# Altium schematic sheet CONTROL_MCU.SchDoc
size A4; SheetNumber: 4; SheetTotal: 5
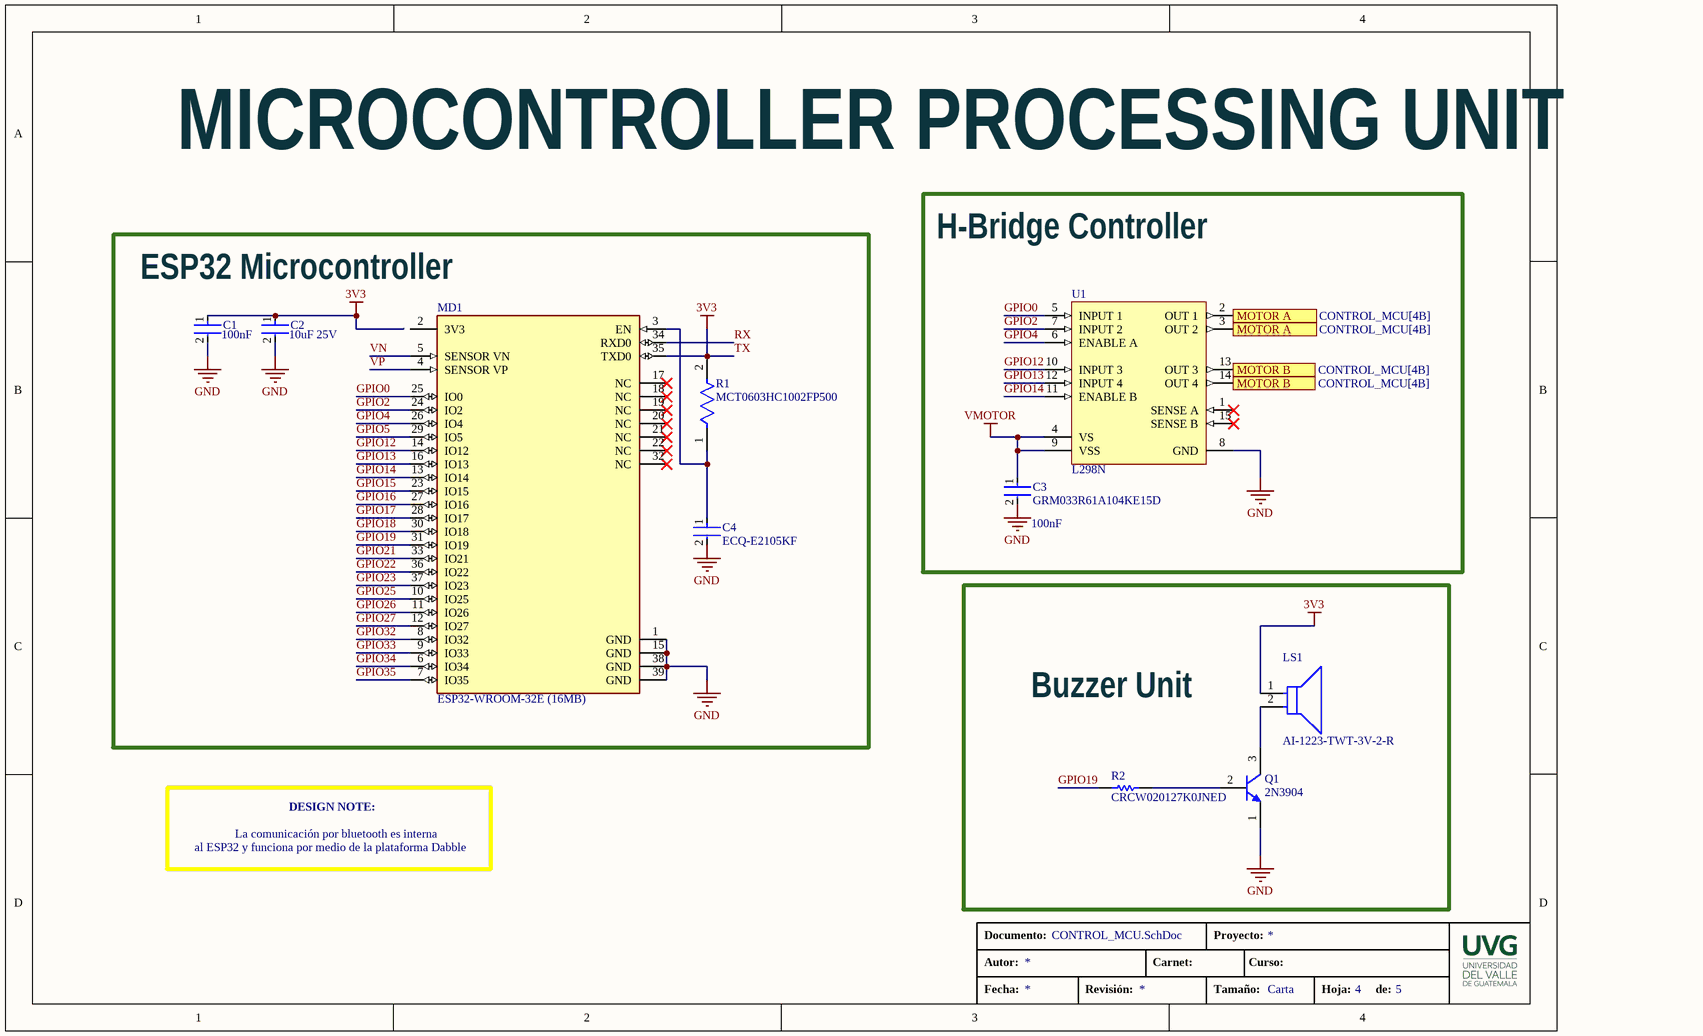
[diagram p0: CONTROL_MCU.SchDoc]

## Parts
C1  Capacitance: 100nF  [FP-GRM033-0_03-IPC_C]  (hidden comment: M033R61A104KE15D)
C2  value 10uF 25V  [FP-ZRB18A-0_2-MFG]  (hidden comment: ZRB18AR61E106KE01L)
C3  GRM033R61A104KE15D  Capacitance: 100nF  [FP-GRM033-0_03-IPC_C]
C4  ECQ-E2105KF  [FP-ECQ-E2105KF-MFG]
LS1  AI-1223-TWT-3V-2-R  [FP-AI-1223-TWT-3V-2-R-MFG]
MD1  ESP32-WROOM-32E (16MB)  [FP-ESP32-WROOM-32E_16MB-MFG]
Q1  2N3904  [ONSC-TO-92-3-29-11]
R1  MCT0603HC1002FP500  [FP-MCT0603-IPC_B]
R2  CRCW020127K0JNED  [RESC0603X28X15ML05T05]
U1  L298N  [STM-FM-15]

## Blocks framed on the sheet
H-Bridge Controller: C3 U1
ESP32 Microcontroller: C1 C2 C4 MD1 R1
Buzzer Unit: LS1 Q1 R2

## Ports
MOTOR A (see CONTROL_MCU[4B]), MOTOR B (see CONTROL_MCU[4B])

## Nets
GND: C1.2 C2.2 C3.2 C4.2 MD1.1(GND) MD1.15(GND) MD1.38(GND) MD1.39(GND) Q1.1(E) U1.8(GND)
TX: C1.1 C2.1 LS1.1(C) MD1.35(TXD0) R1.2  [also labelled 3V3]
VMOTOR: C3.1 U1.4(VS) U1.9(VSS)
GPIO0: MD1.25(IO0) U1.5(INPUT_1)
GPIO2: MD1.24(IO2) U1.7(INPUT_2)
GPIO4: MD1.26(IO4) U1.6(ENABLE_A)
GPIO5: MD1.29(IO5)
GPIO12: MD1.14(IO12) U1.10(INPUT_3)
GPIO13: MD1.16(IO13) U1.12(INPUT_4)
GPIO14: MD1.13(IO14) U1.11(ENABLE_B)
GPIO15: MD1.23(IO15)
GPIO16: MD1.27(IO16)
GPIO17: MD1.28(IO17)
GPIO18: MD1.30(IO18)
GPIO19: MD1.31(IO19) R2.2
GPIO21: MD1.33(IO21)
GPIO22: MD1.36(IO22)
GPIO23: MD1.37(IO23)
GPIO25: MD1.10(IO25)
GPIO26: MD1.11(IO26)
GPIO27: MD1.12(IO27)
GPIO32: MD1.8(IO32)
GPIO33: MD1.9(IO33)
GPIO34: MD1.6(IO34)
GPIO35: MD1.7(IO35)
MOTOR A: U1.2(OUT_1) U1.3(OUT_2) ; port MOTOR A
MOTOR B: U1.13(OUT_3) U1.14(OUT_4) ; port MOTOR B
RX: MD1.34(RXD0)
VN: MD1.5(SENSOR_VN)
VP: MD1.4(SENSOR_VP)
NetC4_1: C4.1 MD1.3(EN) R1.1
NetLS1_2: LS1.2(A) Q1.3(C)
NetQ1_2: Q1.2(B) R2.1

Not connected (* = marked no-connect by the designer): MD1 2(3V3) 17(NC)* 18(NC)* 19(NC)* 20(NC)* 21(NC)* 22(NC)* 32(NC)*; U1 1(SENSE_A)* 15(SENSE_B)*

## Notes on the sheet
- MICROCONTROLLER PROCESSING UNIT
- al ESP32 y funciona por medio de la plataforma Dabble
- La comunicación por bluetooth es interna
- DESIGN NOTE:
- Documento:
- Autor:
- Carnet:
- Proyecto:
- Curso:
- Fecha:
- Revisión:
- Tamaño:
- Carta
- Hoja:
- de:

## Library data of the parts
C1 C3 = CMP-2010-01264-2: Chip Multilayer Ceramic Capacitors for General Purpose, 0201, 0.10uF, X5R, 15%, 10%, 10V; Mount: Surface Mount; Dielectric: X5R; Width: 0.012inch; Tolerance: 10%; Radiation Hardening: No; Voltage Rating: 10V; REACH SVHC: No SVHC; Height: 0.3mm; Max Operating Temperature: 85°C; Voltage Rating (DC): 10V; Thickness: 0.013inch; Termination: SMD/SMT; Lead Free: Lead Free; Package Quantity: 1; Case/Package: 0201; Min Operating Temperature: -55°C; Weight: 6E-06oz; Length: 0.6mm; Case Code (Imperial): 0201; Depth: 0.3mm; Voltage: 10V; Packaging: Tape and Reel; Case Code (Metric): 0603
C2 = CMP-06035-063177-1: Low Acoustic Noise Chip Multilayer Ceramic Capacitors on Interposer Board for General Purpose ZRB Series 0603 Package 1.2mm X5R @ 15% 25Vdc 10uF @ 10%
C4 = CMP-00287-00215881-1: ECQ-E2105KF Cap Film 1uF 250V PET 10% (18.5 X 7.4 X 15mm) Radial 15mm 105 C Bulk; NexarPartId: 215881; Lead Length: 20mm; Lead Diameter: 800µm; Lead/Base Style: Straight; Capacitance: 1µF; Dielectric Material: Polyester; Voltage Rating (AC): 250V; Tolerance: 10%; REACH SVHC: Unknown; Contact Plating: Tin; Height - Seated (Max): 16.002mm; Length: 18.5mm; Lead Free: Lead Free; Voltage Rating: 250V; Dielectric: PET; Height: 15mm; Radiation Hardening: No; Mount: Through Hole; Packaging: Bulk; Min Operating Temperature: -40°C; Width: 7.3914mm; Depth: 7.4mm; Case/Package: Radial; Voltage Rating (DC): 250V; Schedule B: 8532250070, 8532250070; RoHS: Compliant; Termination: Radial; Lead Pitch: 15mm; Max Operating Temperature: 105°C
LS1 = CMP-103888-000003-1: BUZZER MAGNETIC 3V 12MM TH; Min Supply Voltage (DC): 2V; Operating Supply Current: 30mA; Max Supply Voltage (DC): 4V; Input Type: DC; Frequency: 2.3kHz; Series: AI; Nominal Supply Voltage (DC): 3V; Packaging: Tray; Max Operating Temperature: 70°C; Height: 7.5mm; Termination: PC Pins; Max Supply Current: 30mA; Mount: Through Hole; Diameter: 12mm; Voltage Rating: 3V; Sensing Method: Magnetic; Min Operating Temperature: -20°C; Contact Plating: Tin
MD1 = CMP-194065-000027-1: RX TXRX MOD WIFI TRACE ANT SMD
Q1 = CMP-2000-05562-1: General Purpose Transistor, NPN Silicon, 200 mA, 60 V, -55 to 150 degC, 3-Pin TO-92, RoHS, Bulk; Manufacturer: ONSemiconductor; Emitter- Base Voltage VEBO: 6V; Maximum Power Dissipation: 625mW; Maximum DC Collector Current: 0.2A; Collector- Emitter Voltage VCEO Max: 40V; Collector- Base Voltage VCBO: 60V; DC Collector/Base Gain hfe Min: 60; Configuration: Single; Collector-Emitter Saturation Voltage: 0.3V; Gain Bandwidth Product fT: 270MHz; Mounting Style: ThroughHole; Package / Case: TO-92-3(TO-226); Mounting Technology: ThroughHole; Minimum Operating Temperature: -65C; Datasheet Version: Rev. 8, 08/2012; Product Category: BipolarTransistors-BJT; Factory Pack Quantity: 5000; Transistor Polarity: NPN; Package Description: 3-Pin Transistor Outline, Body 4.825 x 3.685 mm, Pitch 1.27 mm; RoHS: Details; Datasheet URL: https://datasheet.ciiva.com/4725/2n3903-d-285841-4725808.pdf; Packaging: Bulk; Maximum Operating Temperature: +150C; Package Reference: TO-92-3-29-11; Brand: ONSemiconductor; Manufacturer URL: http://www.onsemi.com/
R1 = CMP-02407-001090-1: RES SMD 100 OHM 1% 1/8W 0603
R2 = CMP-2004-00383-1: Manufacturer: Vishay Dale; Part Number: CRCW020127K0JNED
U1 = CMP-2000-06526-1: Dual Full-Bridge Driver, 4.8 to 46 V, -40 to 150 degC, 15-Pin FM (MW 15L), RoHS, Tube; Manufacturer: STMicroelectronics; PartNumber: L298; Output Current: 2A; Supply Voltage Max: 7V; Driver Case Style: Multiwatt; Supply Voltage Min: 4.5V; No. of Pins: 15Pins; SVHC: NoSVHC(17-Dec-2015); Output Voltage: 46V; No. of Outputs: 4Outputs; Motor Type: FullBridge; MSL: -; Package Description: 15-Pin Flange Mount, Body 5 x 19.6 mm, Pitch 1.27 mm; Datasheet Version: 01/2000; Package Reference: FM-15; Mounting Technology: ThroughHole; Packaging: Each; Automotive Qualification Standard: -; Product Range: -; Datasheet URL: https://datasheet.ciiva.com/15109/getdatasheetpartid-50682-15109332.pdf; Operating Temperature Max: 130°C; Operating Temperature Min: -25°C; Manufacturer URL: http://www.st.com/